# EAGLE design Powerbank_EC (EAGLE 6.5.0)
made by neutron
CDESIGNER: NeutroN StrikeR; CNAME: POWERBANK_EC; CREVISION: v1.1
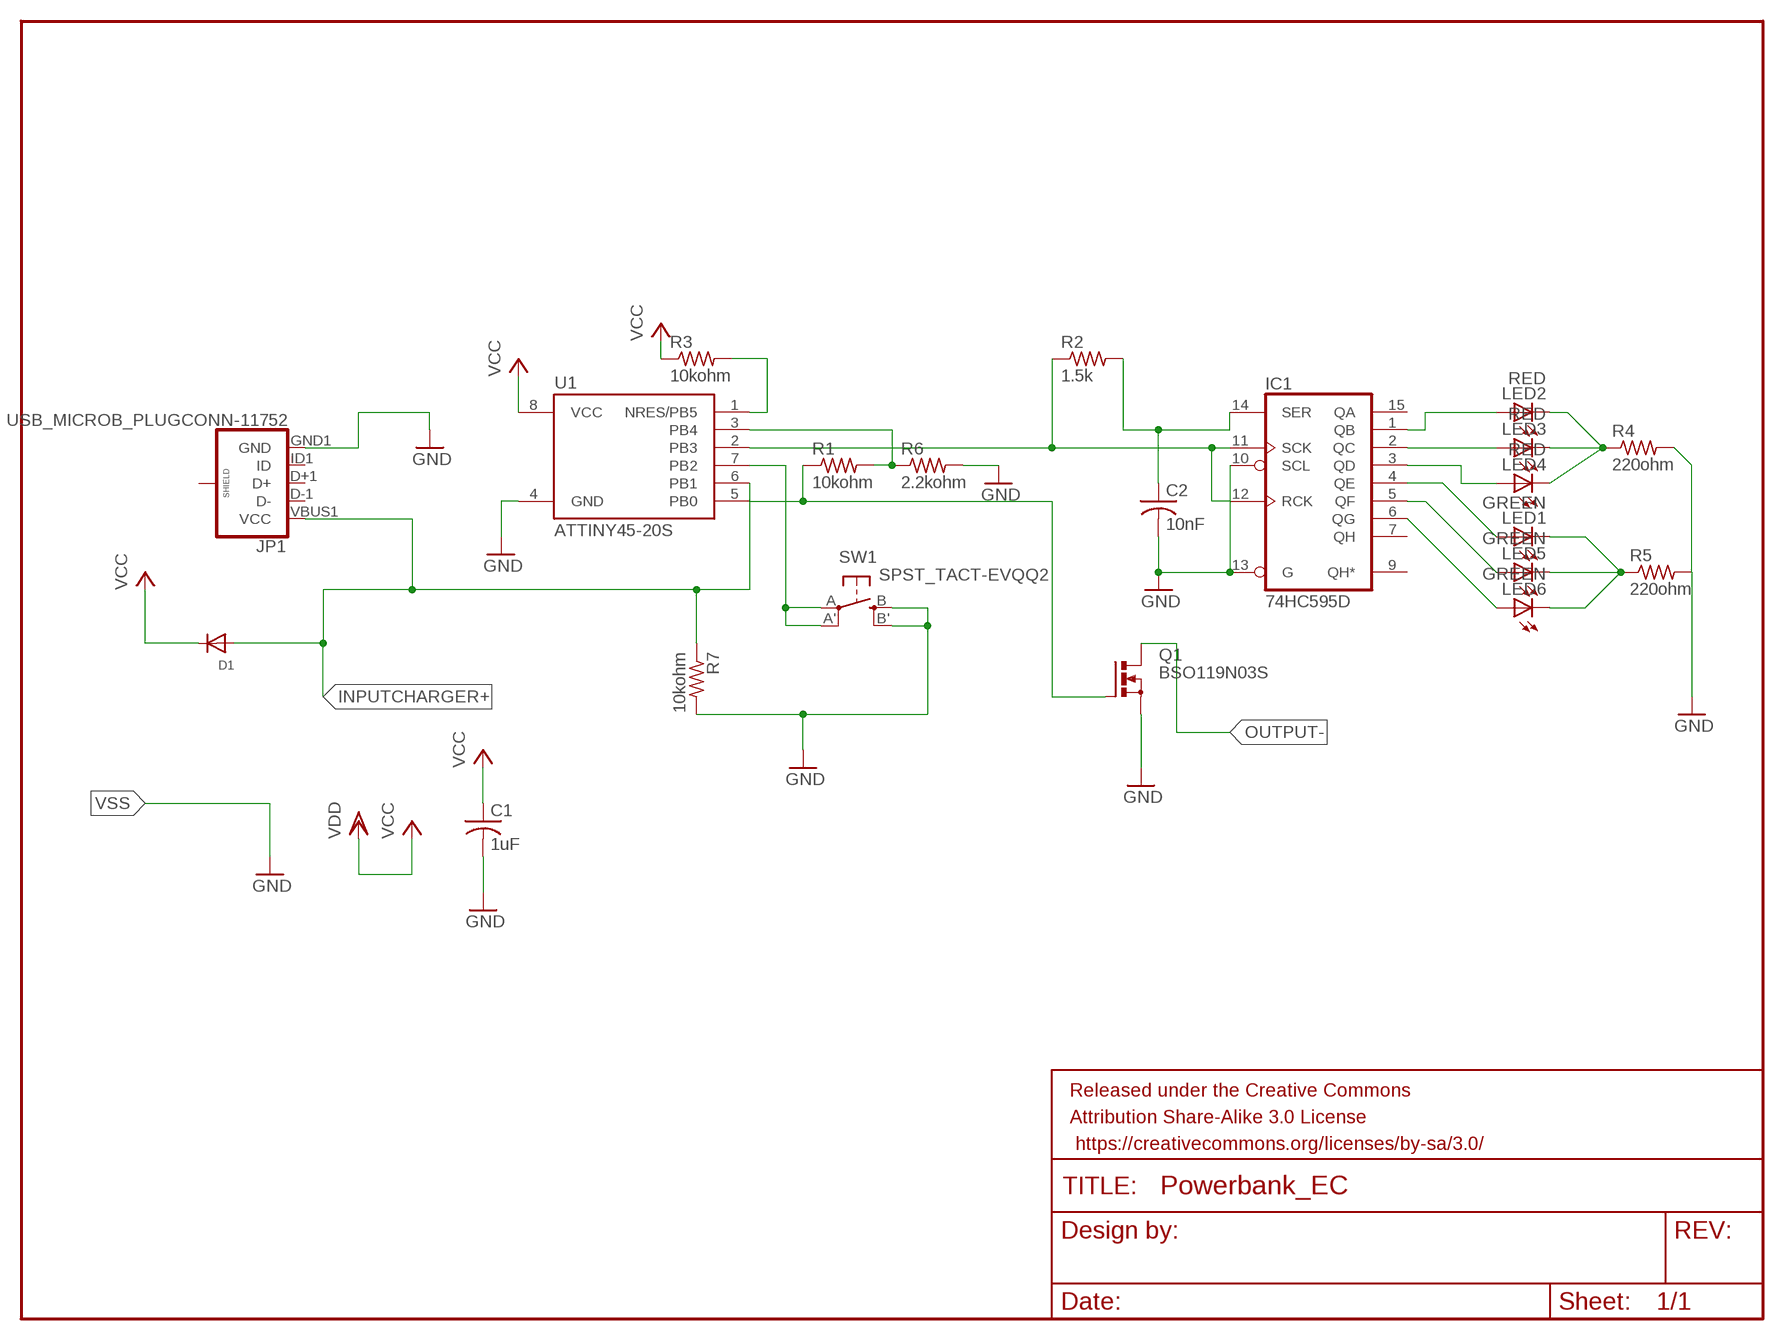
[diagram p0: schematic, sheet 1]

## Parts
C1  1uF  C-USC1206  [C1206]
C2  10nF  C-USC1206  [C1206]
D1  DIODESMA  [SMADIODE]
FRAME1  FRAME-LETTER  [CREATIVE_COMMONS]
IC1  74HC595D  [SO16]
JP1  USB_MICROB_PLUGCONN-11752  [USB-B-MICRO-SMD_V03]
LED1  GREEN  LEDCHIPLED_1206  [CHIPLED_1206]
LED2  RED  LEDCHIPLED_1206  [CHIPLED_1206]
LED3  RED  LEDCHIPLED_1206  [CHIPLED_1206]
LED4  RED  LEDCHIPLED_1206  [CHIPLED_1206]
LED5  GREEN  LEDCHIPLED_1206  [CHIPLED_1206]
LED6  GREEN  LEDCHIPLED_1206  [CHIPLED_1206]
Q1  BSO119N03S  N-MOSFET-SO8S  [SO-08]
R1  10kohm  R-US_M1206  [M1206]
R2  1.5k  R-US_M1206  [M1206]
R3  10kohm  R-US_M1206  [M1206]
R4  220ohm  R-US_M1206  [M1206]
R5  220ohm  R-US_M1206  [M1206]
R6  2.2kohm  R-US_M1206  [M1206]
R7  10kohm  R-US_M1206  [M1206]
SW1  SPST_TACT-EVQQ2  [EVQ-Q2]
U1  ATTINY45-20S  [SOIC8_EIAJ_208MIL]

## Nets
GND: C1.2 JP1.GND1(GND) Q1.1(S) Q1.2(S) Q1.3(S) R7.2 SW1.B'(S1) SW1.B(S)
INPUTCHARGER+: D1.A JP1.VBUS1(VCC) R7.1 U1.6(PB1)
N$1: IC1.1(QB) LED2.A
N$2: IC1.2(QC) LED3.A
N$3: IC1.3(QD) LED4.A
N$4: IC1.4(QE) LED1.A
N$5: IC1.5(QF) LED5.A
N$6: IC1.6(QG) LED6.A
N$7: LED2.C LED3.C LED4.C R4.1
N$8: LED1.C LED5.C LED6.C R5.1
N$9: R3.2 U1.1(NRES/PB5)
N$10: IC1.11(SCK) IC1.12(RCK) R2.1 U1.2(PB3)
N$11: SW1.A'(P1) SW1.A(P) U1.7(PB2)
N$12: C2.1 IC1.14(SER) R2.2
N$13: R1.2 R6.1 U1.3(PB4)
N$14: Q1.4(G) R1.1 U1.5(PB0)
OUTPUT-: Q1.5(D) Q1.6(D) Q1.7(D) Q1.8(D)
VCC: C1.1
VDD: D1.C R3.1 U1.8(VCC) ; supply symbol labelled VCC
VSS: C2.2 IC1.10(SCL) IC1.13(G) R4.2 R5.2 R6.2 U1.4(GND) ; supply symbol labelled GND
Unconnected: IC1.7(QH) IC1.9(QH*) IC1.15(QA) JP1.D+1(D+) JP1.D-1(D-) JP1.ID1(ID) JP1.SHIELD1(SHIELD) JP1.SHIELD2(SHIELD) JP1.SHIELD3(SHIELD)

## Power pins joined to a net without a drawn wire
VDD: IC1.16(VCC)
VSS: IC1.8(GND)

## Library data of the parts
C1 C2 = adafruit:C-US: CAPACITOR, American symbol
D1 = adafruit:DIODE: Diode SMADIODE - SMA Surface Mount Package 20V 1A Schottky Diode Digikey: 641-1014-6-ND DO-1N4148 - Through Hole Small Current Diode SOD-123 20V 1 A (.5mV Vf) Schottky Diode - Digikey: MBRX120TPMSCT-ND SOD-323 10V 570mA (.38mV Vf, 3ns) Schottky Diode - Digikey: ZLLS410CT-ND SOD-523 30V 30mA Schottky Diode (RB751S-40TE61) - Digikey: RB751S-40TE61CT-ND SOT23-R/W - SOT23 Package (R = Solder Paste/Reflow Ovens, W = Hand-Soldering) BAT54Film 40V 300mA - Digikey: 497-7162-1-ND
FRAME1 = SparkFun-Retired:FRAME-LETTER: Schematic Frame Standard 8.5x11 US Letter frame; DESIGNER: Neutron; REVISION: v1.1
IC1 = 74xx-eu:74*595: 8-bit SHIFT REGISTER, output latch
JP1 = SparkFun-Connectors:USB_MICROB_PLUG: USB Micro-B connectors Some male, some female. Watch your step!; PROD_ID: CONN-11752
LED1-LED6 = adafruit:LED: LED OSRAM: - CHIPLED LG R971, LG N971, LY N971, LG Q971, LY Q971, LO R971, LY R971 LH N974, LH R974 LS Q976, LO Q976, LY Q976 LO Q996 - Hyper CHIPLED LW Q18S LB Q993, LB Q99A, LB R99A - SideLED LS A670, LO A670, LY A670, LG A670, LP A670 LB A673, LV A673, LT A673, LW A673 LH A674 LY A675 LS A676, LA A676, LO A676, LY A676, LW A676 LS A679, LY A679, LG A679 - Hyper Micro SIDELED® LS Y876, LA Y876, LO Y876, LY Y876 LT Y87S - SmartLED LW L88C, LW L88S LB L89C, LB L89S, LG L890 LS L89K, LO L89K, LY L89K LS L896, LA L896, LO L896, LY L896 - TOPLED LS T670, LO T670, LY T670, LG T670, LP T670 LSG T670, LSP T670, LSY T670, LOP T670, LYG T670 LG T671, LOG T671, LSG T671 LB T673, LV T673, LT T673, LW T673 LH T674 LS T676, LA T676, LO T676, LY T676, LB T676, LH T676, LSB T676, LW T676 LB T67C, LV T67C, LT T67C, LS T67K, LO T67K, LY T67K, LW E67C LS E67B, LA E67B, LO E67B, LY E67B, LB E67C, LV E67C, LT E67C LW T67C LS T679, LY T679, LG T679 LS T770, LO T770, LY T770, LG T770, LP T770 LB T773, LV T773, LT T773, LW T773 LH T774 LS E675, LA E675, LY E675, LS T675 LS T776, LA T776, LO T776, LY T776, LB T776 LHGB T686 LT T68C, LB T68C - Hyper Mini TOPLED® LB M676 - Mini TOPLED Santana® LG M470 LS M47K, LO M47K, LY M47K Source: http://www.osram.convergy.de/
Q1 = transistor-power:N-MOSFET-SO8: N-Channel MOSFET Example: FDS7760A; N-Channel Logic Level PowerTrench® MOSFET FDS2572; N-Channel UltraFET® Trench MOSFET Source: www.fairchildsemi.com
R1-R7 = adafruit:R-US_: RESISTOR, American symbol
SW1 = adafruit:SPST_TACT: SMT 6mm switch, EVQQ2 series http://www.ladyada.net/library/eagle
U1 = _hhn_attiny25_45_85:ATTINY45*: ATMEL ATtiny 45 Packages: P = PDIP 08 30mil S = SOIC 08 EIAJ 208mil X = TSSOP 08 4.4mm Technologies Note: for complete ordering code (temp. range, finish, tape&reel etc.) see www.atmel.com • Supply Voltage: V = (1.8…5.5)V | [blank] = (2.7…5.5)V • Speed: 10 = 10 MHz | 20 = 20 MHz Author: Dipl.-Ing. FH Rainer Bayer HHN Hochschule Heilbronn (Heilbronn University), rainer.bayer@hs-heilbronn.de Ingenieurbüro ing-rb, mail@ing-rb.de

## Board
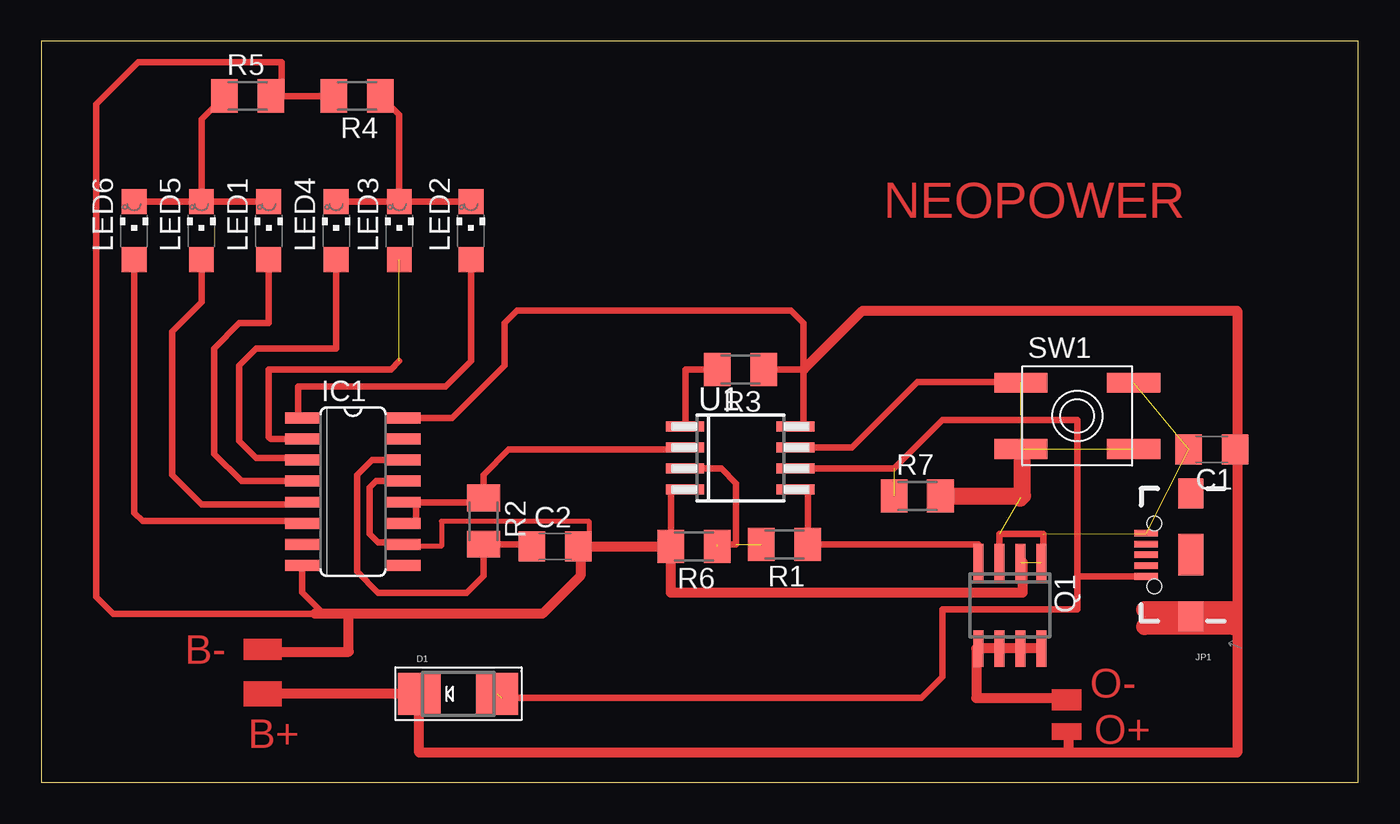
[diagram p1: board, top side]

Size 79.43 x 44.69 mm. Coordinates in mm from the lower left corner, seen from the top.
Outline: 0,0 79.43,0 79.43,44.69 0,44.69 0,0
Copper layers (1*16): Top 0.035mm / dielectric 1.5mm / Bottom 0.035mm
Design rules "default": minimum track width 10mil, minimum drill 24mil, track to track 8mil, track to pad 8mil, pad to pad 8mil, via to via 8mil, smd to smd 8mil, copper to edge 40mil, drill to drill 8mil, minimum pad ring 10mil, minimum via ring 8mil, stop-mask expansion 4mil, vias tented up to drill 0mil, thermal gap 10mil

### Footprints (pad centres in the part's own frame; a part is rotated, then mirrored left to right if it is on the bottom)
C1206 = smd 1.6 x 1.8: 1 -1.4,0; 2 1.4,0
SMADIODE = smd 2.54 x 2.54: A 2.349,0; C -2.349,0
SO16 = smd 0.66 x 2.032: 1 -4.445,-3.073; 2 -3.175,-3.073; 3 -1.905,-3.073; 4 -0.635,-3.073; 5 0.635,-3.073; 6 1.905,-3.073; 7 3.175,-3.073; 8 4.445,-3.073; 9 4.445,3.073; 10 3.175,3.073; 11 1.905,3.073; 12 0.635,3.073; 13 -0.635,3.073; 14 -1.905,3.073; 15 -3.175,3.073; 16 -4.445,3.073
USB-B-MICRO-SMD_V03 = smd 1.4 x 0.4: D+1 2.7,0; D-1 2.7,0.65; GND1 2.7,-1.3; ID1 2.7,-0.65; VBUS1 2.7,1.3 | smd 1.5 x 1.8: SHIELD1 0,3.7; SHIELD2 0,-3.7 | smd 1.5 x 2.5: SHIELD3 0,0 | hole 0.85: 2.2,1.9; 2.2,-1.9
CHIPLED_1206 = smd 1.5 x 1.5: A 0,-1.75; C 0,1.75
SO-08 = smd 0.6 x 2.2: 1 -1.905,-2.6; 2 -0.635,-2.6; 3 0.635,-2.6; 4 1.905,-2.6; 5 1.905,2.6; 6 0.635,2.6; 7 -0.635,2.6; 8 -1.905,2.6
M1206 = smd 1.6 x 2: 1 -1.4,0; 2 1.4,0
EVQ-Q2 = smd 3.2 x 1.2: A -3.4,-2; A' 3.4,-2; B -3.4,2; B' 3.4,2
SOIC8_EIAJ_208MIL = smd 0.6 x 2.286: 1 -1.905,-3.33; 2 -0.635,-3.33; 3 0.635,-3.33; 4 1.905,-3.33; 5 1.905,3.33; 6 0.635,3.33; 7 -0.635,3.33; 8 -1.905,3.33

### Placement (x,y rotation side)
C1  70.61,20.07 180 top
C2  30.99,14.22 0 top
D1  25.15,5.33 0 top
FRAME1  21.08,-7.62 0 top  (outside the outline)
IC1  18.8,17.53 270 top
JP1  69.34,13.72 180 top
LED1  13.72,33.27 0 top
LED2  25.91,33.27 0 top
LED3  21.59,33.27 0 top
LED4  17.78,33.27 0 top
LED5  9.65,33.27 0 top
LED6  5.59,33.27 0 top
Q1  58.42,10.67 180 top
R1  44.83,14.35 180 top
R2  26.67,15.75 270 top
R3  42.16,24.89 180 top
R4  19.05,41.4 180 top
R5  12.45,41.4 0 top
R6  39.37,14.22 180 top
R7  52.83,17.27 0 top
SW1  62.48,22.1 0 top
U1  42.16,19.56 270 top

### Tracks (layer width: path | path; a pad name or v marks a point on that pad's centre or on a via)
GND  (6 unrouted)
  Top 0.406: Q1.1 60.45,13.27 60.45,14.99 57.78,14.99 Q1.3
  Top 1.016: R7.2 59.18,17.27 | 59.18,17.27 59.18,20 | 59.05,17.14 59.18,17.27
INPUTCHARGER+  (3 unrouted)
  Top 0.406: U1.6 51.43,18.92 | 51.43,18.92 54.36,21.84 62.48,21.84 62.48,12.45 62.48,12.42 | 62.48,12.42 62.48,10.41 54.36,10.41 54.36,6.35 53.09,5.08 27.75,5.08 | JP1.VBUS1 62.48,12.42
N$1
  Top 0.406: IC1.1 15.49,21.97 15.49,23.88 24.38,23.88 25.91,25.4 LED2.A
N$2  (1 unrouted)
  Top 0.406: IC1.2 13.84,20.7 13.72,20.83 13.72,24.89 21.08,24.89 21.59,25.4
N$3
  Top 0.406: IC1.3 15.88,19.43 16,19.56 12.95,19.56 11.94,20.57 11.94,25.15 12.95,26.16 17.78,26.16 LED4.A
N$4
  Top 0.406: IC1.4 12.06,18.16 10.41,19.81 10.41,26.16 11.94,27.69 13.72,27.69 LED1.A
N$5
  Top 0.406: LED5.A 9.65,28.96 7.87,27.18 7.87,18.54 9.65,16.76 15.6,16.76 IC1.5
N$6
  Top 0.406: LED6.A 5.59,16.26 6.1,15.75 15.6,15.75 IC1.6
N$7
  Top 0.406: LED3.C 21.59,40.26 R4.1 | LED4.C LED3.C | LED3.C LED2.C
N$8
  Top 0.406: LED6.C LED5.C | LED5.C LED1.C | LED5.C 9.65,40.01 R5.1
N$9
  Top 0.406: U1.1 38.86,21.46 38.86,24.89 R3.2
N$10
  Top 0.406: U1.2 38.71,20.07 28.19,20.07 26.67,18.54 R2.1 26.67,16.89 22.61,16.89 | IC1.12 22.61,16.89 | IC1.11 22.61,15.62 22.61,16.89
N$11  (2 unrouted)
  Top 0.406: U1.7 48.9,20.19 52.83,24.13 59.05,24.13
N$12
  Top 0.406: C2.1 29.59,14.35 R2.2 26.67,12.45 25.65,11.43 20.32,11.43 19.05,12.7 19.05,18.54 19.94,19.43 IC1.14
N$13  (2 unrouted)
  Top 0.406: 40.77,14.35 41.91,14.35 41.91,18.03 41.02,18.92 U1.3
N$14
  Top 0.406: U1.5 46.23,17.65 R1.1 56.52,14.35 Q1.4
N$16
  Top 1.016: 66.55,10.41 71.88,10.41 71.88,9.4 66.55,9.4
OUTPUT-
  Top 0.61: 61.21,5.08 56.39,5.08 56.39,8.07 Q1.5 Q1.6 Q1.7 Q1.8
VDD  (1 unrouted)
  Top 0.406: R3.1 45.97,24.89 | IC1.16 24.77,21.97 27.94,25.15 27.94,27.69 28.7,28.45 45.21,28.45 45.97,27.69 45.97,24.89 | 45.97,21.59 45.97,24.89
  Top 0.61: 13.97,5.33 D1.C 22.8,1.78 61.98,1.78 | 61.98,1.78 72.14,1.78 72.14,28.45 49.53,28.45 45.97,24.89 | 61.98,1.78 61.98,3.05
VSS
  Top 0.305: IC1.10 21.87,14.22 24.13,14.22 24.13,15.75 33.02,15.75 33.02,14.22
  Top 0.406: U1.4 37.97,17.65 R6.2 | IC1.13 20.19,18.16 19.81,17.78 19.81,14.99 20.32,14.48 21.74,14.48 IC1.10 | 32.77,14.22 C2.2 32.51,14.1 | IC1.8 15.72,11.46 17.02,10.16 16.51,10.16 4.32,10.16 3.3,11.18 3.3,40.89 5.84,43.43 14.48,43.43 14.48,41.4 R4.2 R5.2
  Top 0.61: C2.2 33.02,14.22 R6.2 37.97,11.43 59.18,11.43 59.18,13.27 | 32.51,14.1 32.51,12.45 30.23,10.16 18.54,10.16 | 18.54,10.16 16.51,10.16 | 13.46,7.87 18.54,7.87 18.54,10.16
(copper drawn outside any net)
  shapes: Top area x4

### Text on the board
Top: NEOPOWER | B- | O- | B+ | O+